# Altium schematic sheet power.SchDoc
size A4; DocumentNumber: 3; SheetNumber: 5
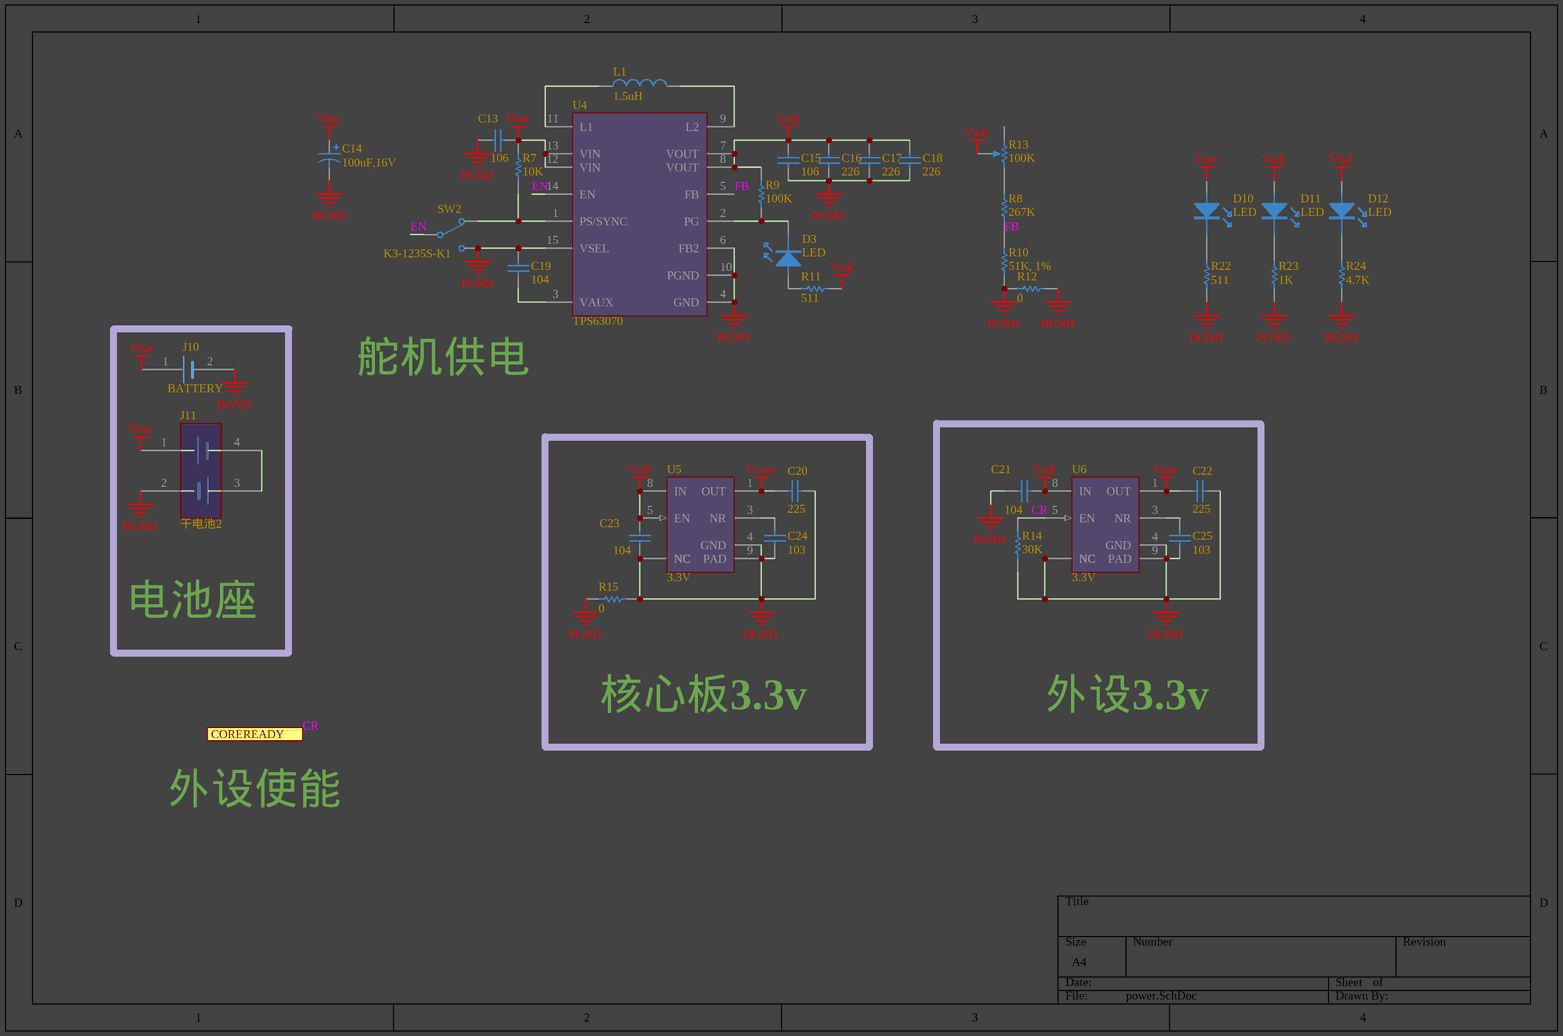
[diagram p0: power.SchDoc]

## Parts
C13  106  [C0603]
C14  100uF,16V  [贴片电解 6.3*5.4]
C15  106  [C0603]
C16  226  [0805C]
C17  226  [0805C]
C18  226  [0805C]
C19  104  [C0402]
C20  225  [C0603]
C21  104  [C0402]
C22  225  [C0603]
C23  104  [C0402]
C24  103  [C0402]
C25  103  [C0402]
D3  LED  [LED 0603R]
D10  LED  [LED 0603Y]
D11  LED  [LED 0603G]
D12  LED  [LED 0603B]
J10  BATTERY  [T接头]
J11  干电池2  [18650x2]
L1  1.5uH  [L5X5]
R7  10K  [R0402]
R8  267K  [R0402]
R9  100K  [R0402]
R10  51K, 1%  [R0402]
R11  511  [R0402]
R12  0  [R0603]
R13  100K  [3296W]
R14  30K  [R0402]
R15  0  [R0603]
R22  511  [R0402]
R23  1K  [R0402]
R24  4.7K  [R0402]
SW2  K3-1235S-K1  [K3-1235S-K1]
U4  TPS63070  [VQFN-15]
U5  3.3V  [VSON-8]
U6  3.3V  [VSON-8]

## Blocks framed on the sheet
电池座: J10 J11
核心板3.3v: C20 C23 C24 R15 U5
外设3.3v: C21 C22 C25 R14 U6

## Ports
COREREADY (in)

## Nets
BGND: C14.2 J10.2(+) J11.2(+) R12.1 R24.1
DGND: C20.2 C22.2 C23.1 C24.1 C25.1 R14.2 R15.1 R22.1 U5.2(NC) U5.4(GND) U5.6(NC) U5.7(NC) U5.9(PAD) U6.2(NC) U6.4(GND) U6.6(NC) U6.7(NC) U6.9(PAD)
PGND: C13.2 C15.1 C16.1 C17.1 C18.1 C19.2 C21.2 R10.2 R12.2 R15.2 R23.1 SW2.3 U4.4(GND) U4.6(FB2) U4.10(PGND) U4.15(VSEL)
Vadj: C15.2 C16.2 C17.2 C18.2 C21.1 C23.2 D11.A R9.2 R11.1 R13.2(TAP) U4.7(VOUT) U4.8(VOUT) U5.5(EN) U5.8(IN) U6.8(IN)
Vbat: C13.1 C14.1 D12.A J10.1(+) J11.1(+) R7.2 U4.12(VIN) U4.13(VIN)
Vcore: C20.1 U5.1(OUT)
Vper: C22.1 D10.A U6.1(OUT)
CR: R14.1 U6.5(EN) ; port COREREADY
EN: SW2.2 U4.14(EN)
FB: R8.2 R10.1 U4.5(FB)
NetC19_1: C19.1 U4.3(VAUX)
NetC24_2: C24.2 U5.3(NR)
NetC25_2: C25.2 U6.3(NR)
NetD3_A: D3.A R11.2
NetD3_K: D3.K R9.1 U4.2(PG)
NetD10_K: D10.K R22.2
NetD11_K: D11.K R23.2
NetD12_K: D12.K R24.2
NetJ11_3: J11.3(+) J11.4(+)
NetL1_1: L1.1 U4.11(L1)
NetL1_2: L1.2 U4.9(L2)
NetR7_1: R7.1 SW2.1 U4.1(PS/SYNC)
NetR8_1: R8.1 R13.3(BOT)

Not connected (* = marked no-connect by the designer): R13 1(TOP)

## Notes on the sheet
- 舵机供电
- 外设使能

## Library data of the parts
C13 C15-C19 C21 C23-C25 = 电容: Capacitor; Value: 22pF; Published: 8-Jun-2000; LatestRevisionDate: 17-Jul-2002; LatestRevisionNote: Re-released for DXP Platform.; PackageReference: RAD-0.3; Publisher: Altium Limited; PackageDescription: Radial Cap, Thru-Hole; 2 Leads; 0.3 in Pin Spacing
C14 = 电解电容: Polarized Capacitor (Axial); Value: 100pF; Published: 8-Jun-2000; LatestRevisionDate: 17-Jul-2002; LatestRevisionNote: Re-released for DXP Platform.; PackageReference: POLAR0.8; Publisher: Altium Limited; PackageDescription: Polarized Capacitor; 2 Leads
C20 C22 = 电容: X5R Capacitor; Value: 22pF; Published: 8-Jun-2000; LatestRevisionDate: 17-Jul-2002; LatestRevisionNote: Re-released for DXP Platform.; PackageReference: RAD-0.3; Publisher: Altium Limited; PackageDescription: Radial Cap, Thru-Hole; 2 Leads; 0.3 in Pin Spacing
L1 = 贴片电感: 4.6A, 14.4mOhm
R7-R12 R14 R15 R22-R24 = 电阻: Resistor; Value: 150R; Published: 8-Jun-2000; LatestRevisionDate: 17-Jul-2002; LatestRevisionNote: Re-released for DXP Platform.; PackageReference: AXIAL-0.3; Publisher: Altium Limited; PackageDescription: Axial Device, Thru-Hole; 2 Leads; 0.3 in Pin Spacing
R13 = 电位器
SW2 = 单刀双掷: Switch
U5 U6 = TPS73512DRBR: No Description Available; Alternate_PartNumber: TPS73512DRBT; Manufacturer: Texas Instruments; CompType: IC; PIN_COUNT: 9; Application_BuildNumber: *; PartNumber: TPS73512DRBR; PackageReference: DRB0008A; MountType: SMT; RoHS: Y; RefDes: RefDes; Type: DEV; Value: Value; Copyright: Copyright (C) 2018 Accelerated Designs. All rights reserved